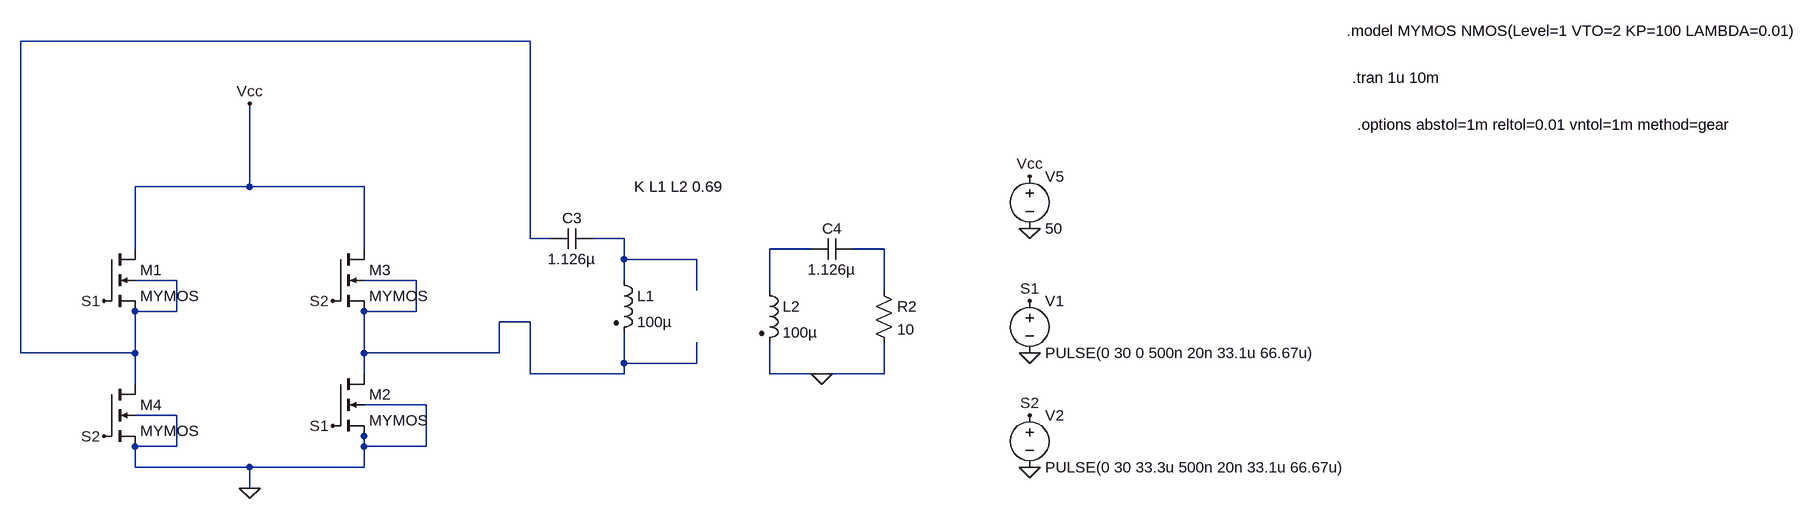
[diagram p0: schematic SYSTEM 1 SS H BRIDGE.asc]
SYSTEM 1 SS H BRIDGE.asc, the LTspice schematic file:
Version 4.1
SHEET 1 2356 696
WIRE 256 -480 -528 -480
WIRE -176 -256 -176 -384
WIRE -176 -256 -352 -256
WIRE 0 -256 -176 -256
WIRE 256 -176 256 -480
WIRE 288 -176 256 -176
WIRE 400 -176 352 -176
WIRE -352 -160 -352 -256
WIRE 0 -160 0 -256
WIRE 688 -160 624 -160
WIRE 800 -160 752 -160
WIRE 400 -144 400 -176
WIRE 512 -144 400 -144
WIRE -288 -112 -352 -112
WIRE 80 -112 0 -112
WIRE 400 -112 400 -144
WIRE 512 -96 512 -144
WIRE 624 -96 624 -160
WIRE 800 -96 800 -160
WIRE -288 -64 -288 -112
WIRE -288 -64 -352 -64
WIRE 0 -64 0 -80
WIRE 80 -64 80 -112
WIRE 80 -64 0 -64
WIRE 256 -48 208 -48
WIRE -528 0 -528 -480
WIRE -352 0 -352 -64
WIRE -352 0 -528 0
WIRE 0 0 0 -64
WIRE 208 0 208 -48
WIRE 208 0 0 0
WIRE 400 16 400 -32
WIRE 512 16 512 -16
WIRE 512 16 400 16
WIRE 0 32 0 0
WIRE 256 32 256 -48
WIRE 400 32 400 16
WIRE 400 32 256 32
WIRE 624 32 624 -16
WIRE 704 32 624 32
WIRE 800 32 800 -16
WIRE 800 32 704 32
WIRE -352 48 -352 0
WIRE 96 80 0 80
WIRE -288 96 -352 96
WIRE 0 128 0 112
WIRE -288 144 -288 96
WIRE -288 144 -352 144
WIRE 0 144 0 128
WIRE 96 144 96 80
WIRE 96 144 0 144
WIRE -352 176 -352 144
WIRE -176 176 -352 176
WIRE 0 176 0 144
WIRE 0 176 -176 176
WIRE -176 208 -176 176
FLAG -176 -384 Vcc
FLAG -176 208 0
FLAG -400 -80 S1
FLAG -48 -80 S2
FLAG -48 112 S1
FLAG -400 128 S2
FLAG 1024 -80 S1
FLAG 1024 0 0
FLAG 1024 96 S2
FLAG 1024 176 0
FLAG 1024 -272 Vcc
FLAG 1024 -192 0
FLAG 704 32 0
SYMBOL nmos4 -400 -160 R0
SYMATTR InstName M1
SYMATTR Value MYMOS
SYMBOL nmos4 -48 32 R0
SYMATTR InstName M2
SYMATTR Value MYMOS
SYMBOL nmos4 -48 -160 R0
SYMATTR InstName M3
SYMATTR Value MYMOS
SYMBOL nmos4 -400 48 R0
SYMATTR InstName M4
SYMATTR Value MYMOS
SYMBOL ind2 384 -128 R0
SYMATTR InstName L1
SYMATTR Value 100µ
SYMATTR Type ind
SYMATTR SpiceLine Rser=0.1
SYMBOL cap 288 -192 M90
WINDOW 0 0 32 VBottom 2
WINDOW 3 32 32 VTop 2
SYMATTR InstName C3
SYMATTR Value 1.126µ
SYMBOL cap 688 -176 M90
WINDOW 0 0 32 VBottom 2
WINDOW 3 32 32 VTop 2
SYMATTR InstName C4
SYMATTR Value 1.126µ
SYMBOL res 784 -112 R0
SYMATTR InstName R2
SYMATTR Value 10
SYMBOL ind2 608 -112 R0
SYMATTR InstName L2
SYMATTR Value 100µ
SYMATTR Type ind
SYMATTR SpiceLine Rser=0.1
SYMBOL voltage 1024 -96 R0
WINDOW 123 0 0 Left 0
WINDOW 39 0 0 Left 0
SYMATTR InstName V1
SYMATTR Value PULSE(0 30 0 500n 20n 33.1u 66.67u)
SYMBOL voltage 1024 80 R0
WINDOW 123 0 0 Left 0
WINDOW 39 0 0 Left 0
SYMATTR InstName V2
SYMATTR Value PULSE(0 30 33.3u 500n 20n 33.1u 66.67u)
SYMBOL voltage 1024 -288 R0
WINDOW 123 0 0 Left 0
WINDOW 39 0 0 Left 0
SYMATTR InstName V5
SYMATTR Value 50
TEXT 1520 -424 Left 2 !.tran 1u 10m
TEXT 416 -256 Left 2 !K L1 L2 0.69
TEXT 1512 -496 Left 2 !.model MYMOS NMOS(Level=1 VTO=2 KP=100 LAMBDA=0.01)
TEXT 1528 -352 Left 2 !.options abstol=1m reltol=0.01 vntol=1m method=gear

The netlist it stands for:
* SYSTEM 1 SS H BRIDGE.asc
M1 Vcc S1 N001 N001 MYMOS
M2 N005 S1 0 0 MYMOS
M3 Vcc S2 N005 N005 MYMOS
M4 N001 S2 0 0 MYMOS
L1 N002 N005 100µ Rser=0.1
C3 N001 N002 1.126µ
C4 N003 N004 1.126µ
R2 N004 0 10
L2 N003 0 100µ Rser=0.1
V1 S1 0 PULSE(0 30 0 500n 20n 33.1u 66.67u)
V2 S2 0 PULSE(0 30 33.3u 500n 20n 33.1u 66.67u)
V5 Vcc 0 50
.model NMOS NMOS
.model PMOS PMOS
.lib standard.mos
.tran 1u 10m
K L1 L2 0.69
.model MYMOS NMOS(Level=1 VTO=2 KP=100 LAMBDA=0.01)
.options abstol=1m reltol=0.01 vntol=1m method=gear
.backanno
.end